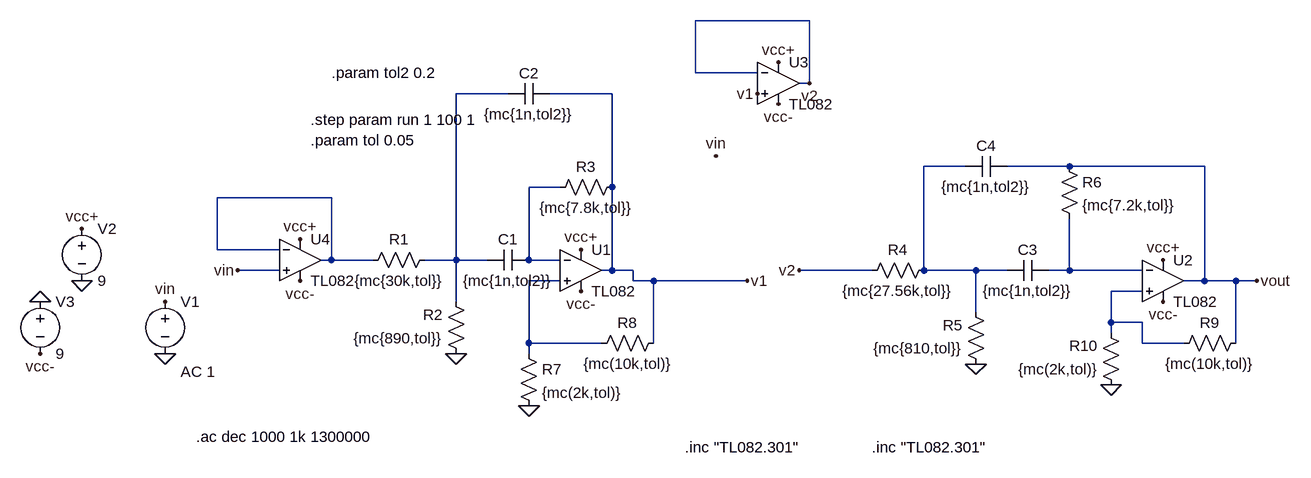
[diagram p0: schematic ej22mejorado.asc]
ej22mejorado.asc, the LTspice schematic file:
Version 4
SHEET 1 1380 680
WIRE 624 -224 448 -224
WIRE 448 -144 448 -224
WIRE 544 -144 448 -144
WIRE 624 -128 624 -224
WIRE 624 -128 608 -128
WIRE 160 -112 80 -112
WIRE 320 -112 224 -112
WIRE 864 0 800 0
WIRE 1024 0 928 0
WIRE 1232 0 1024 0
WIRE 240 32 192 32
WIRE 320 32 320 -112
WIRE -112 48 -288 48
WIRE -288 128 -288 48
WIRE -192 128 -288 128
WIRE -112 144 -112 48
WIRE -112 144 -128 144
WIRE -48 144 -112 144
WIRE 80 144 80 -112
WIRE 80 144 32 144
WIRE 128 144 80 144
WIRE 192 144 192 32
WIRE 240 144 192 144
WIRE -192 160 -256 160
WIRE 320 160 320 32
WIRE 320 160 304 160
WIRE 352 160 320 160
WIRE 720 160 608 160
WIRE 800 160 800 0
WIRE 880 160 800 160
WIRE 928 160 880 160
WIRE 1024 160 1024 80
WIRE 1024 160 992 160
WIRE 1136 160 1024 160
WIRE 240 176 192 176
WIRE 352 176 352 160
WIRE 384 176 352 176
WIRE 528 176 384 176
WIRE 1232 176 1232 0
WIRE 1232 176 1200 176
WIRE 1280 176 1232 176
WIRE 1312 176 1280 176
WIRE 1136 192 1088 192
WIRE 80 208 80 144
WIRE 880 224 880 160
WIRE 1088 240 1088 192
WIRE 1136 240 1088 240
WIRE 1088 256 1088 240
WIRE 192 272 192 176
WIRE 304 272 192 272
WIRE 384 272 384 176
WIRE 1136 272 1136 240
WIRE 1200 272 1136 272
WIRE 1280 272 1280 176
WIRE 192 288 192 272
FLAG 192 368 0
FLAG 80 288 0
FLAG -368 288 0
FLAG 272 128 vcc+
FLAG 272 192 vcc-
FLAG -496 176 0
FLAG -560 208 0
FLAG -496 96 vcc+
FLAG -560 288 vcc-
FLAG 1088 336 0
FLAG 880 304 0
FLAG 1168 144 vcc+
FLAG 1168 208 vcc-
FLAG 576 -160 vcc+
FLAG 576 -96 vcc-
FLAG -160 112 vcc+
FLAG -160 176 vcc-
FLAG 528 176 v1
FLAG 544 -112 v1
FLAG 624 -128 v2
FLAG 608 160 v2
FLAG -368 208 vin
FLAG -256 160 vin
FLAG 480 -16 vin
FLAG 1312 176 vout
SYMBOL res 48 128 R90
WINDOW 0 0 56 VBottom 2
WINDOW 3 32 56 VTop 2
SYMATTR InstName R1
SYMATTR Value {mc{30k,tol}}
SYMBOL res 96 304 R180
WINDOW 0 36 76 Left 2
WINDOW 3 36 40 Left 2
SYMATTR InstName R2
SYMATTR Value {mc{890,tol}}
SYMBOL res 224 48 R270
WINDOW 0 32 56 VTop 2
WINDOW 3 0 56 VBottom 2
SYMATTR InstName R3
SYMATTR Value {mc{7.8k,tol}}
SYMBOL cap 192 128 R90
WINDOW 0 0 32 VBottom 2
WINDOW 3 32 32 VTop 2
SYMATTR InstName C1
SYMATTR Value {mc{1n,tol2}}
SYMBOL cap 224 -128 R90
WINDOW 0 0 32 VBottom 2
WINDOW 3 32 32 VTop 2
SYMATTR InstName C2
SYMATTR Value {mc{1n,tol2}}
SYMBOL Opamps\\opamp2 272 96 R0
SYMATTR InstName U1
SYMATTR Value TL082
SYMBOL voltage -368 192 R0
WINDOW 123 24 124 Left 2
WINDOW 39 0 0 Left 2
SYMATTR Value2 AC 1
SYMATTR InstName V1
SYMATTR Value ""
SYMBOL voltage -496 80 R0
WINDOW 123 0 0 Left 0
WINDOW 39 0 0 Left 0
SYMATTR InstName V2
SYMATTR Value 9
SYMBOL voltage -560 192 R0
WINDOW 123 0 0 Left 0
WINDOW 39 0 0 Left 0
SYMATTR InstName V3
SYMATTR Value 9
SYMBOL res 816 144 R90
WINDOW 0 0 56 VBottom 2
WINDOW 3 32 56 VTop 2
SYMATTR InstName R4
SYMATTR Value {mc{27.56k,tol}}
SYMBOL res 896 320 R180
WINDOW 0 36 76 Left 2
WINDOW 3 36 40 Left 2
SYMATTR InstName R5
SYMATTR Value {mc{810,tol}}
SYMBOL res 1008 -16 R0
SYMATTR InstName R6
SYMATTR Value {mc{7.2k,tol}}
SYMBOL cap 992 144 R90
WINDOW 0 0 32 VBottom 2
WINDOW 3 32 32 VTop 2
SYMATTR InstName C3
SYMATTR Value {mc{1n,tol2}}
SYMBOL cap 928 -16 R90
WINDOW 0 0 32 VBottom 2
WINDOW 3 32 32 VTop 2
SYMATTR InstName C4
SYMATTR Value {mc{1n,tol2}}
SYMBOL Opamps\\opamp2 1168 112 R0
SYMATTR InstName U2
SYMATTR Value TL082
SYMBOL Opamps\\opamp2 576 -192 R0
SYMATTR InstName U3
SYMATTR Value TL082
SYMBOL res 176 272 R0
SYMATTR InstName R7
SYMATTR Value {mc(2k,tol)}
SYMBOL res 400 256 R90
WINDOW 0 0 56 VBottom 2
WINDOW 3 32 56 VTop 2
SYMATTR InstName R8
SYMATTR Value {mc(10k,tol)}
SYMBOL res 1296 256 R90
WINDOW 0 0 56 VBottom 2
WINDOW 3 32 56 VTop 2
SYMATTR InstName R9
SYMATTR Value {mc(10k,tol)}
SYMBOL res 1104 352 R180
WINDOW 0 36 76 Left 2
WINDOW 3 36 40 Left 2
SYMATTR InstName R10
SYMATTR Value {mc(2k,tol)}
SYMBOL Opamps\\opamp2 -160 80 R0
SYMATTR InstName U4
SYMATTR Value TL082
TEXT 720 432 Left 2 !.inc "TL082.301"
TEXT -320 416 Left 2 !.ac dec 1000 1k 1300000
TEXT 432 432 Left 2 !.inc "TL082.301"
TEXT -144 -40 Left 2 !.param tol 0.05
TEXT -144 -72 Left 2 !.step param run 1 100 1
TEXT -112 -144 Left 2 !.param tol2 0.2

The netlist it stands for:
* ej22mejorado.asc
R1 N001 N004 {mc{30k,tol}}
R2 0 N001 {mc{890,tol}}
R3 N003 v1 {mc{7.8k,tol}}
C1 N003 N001 {mc{1n,tol2}}
C2 v1 N001 {mc{1n,tol2}}
XU1 N006 N003 vcc+ vcc- v1 TL082  ; pins In+ In- V+ V- OUT
V1 vin 0 AC 1
V2 vcc+ 0 9
V3 0 vcc- 9
R4 N002 v2 {mc{27.56k,tol}}
R5 0 N002 {mc{810,tol}}
R6 vout N005 {mc{7.2k,tol}}
C3 N005 N002 {mc{1n,tol2}}
C4 vout N002 {mc{1n,tol2}}
XU2 N007 N005 vcc+ vcc- vout TL082  ; pins In+ In- V+ V- OUT
XU3 v1 v2 vcc+ vcc- v2 TL082  ; pins In+ In- V+ V- OUT
R7 N006 0 {mc(2k,tol)}
R8 v1 N006 {mc(10k,tol)}
R9 vout N007 {mc(10k,tol)}
R10 0 N007 {mc(2k,tol)}
XU4 vin N004 vcc+ vcc- N004 TL082  ; pins In+ In- V+ V- OUT
.inc "TL082.301"
.ac dec 1000 1k 1300000
.inc "TL082.301"
.param tol 0.05
.step param run 1 100 1
.param tol2 0.2
.backanno
.end